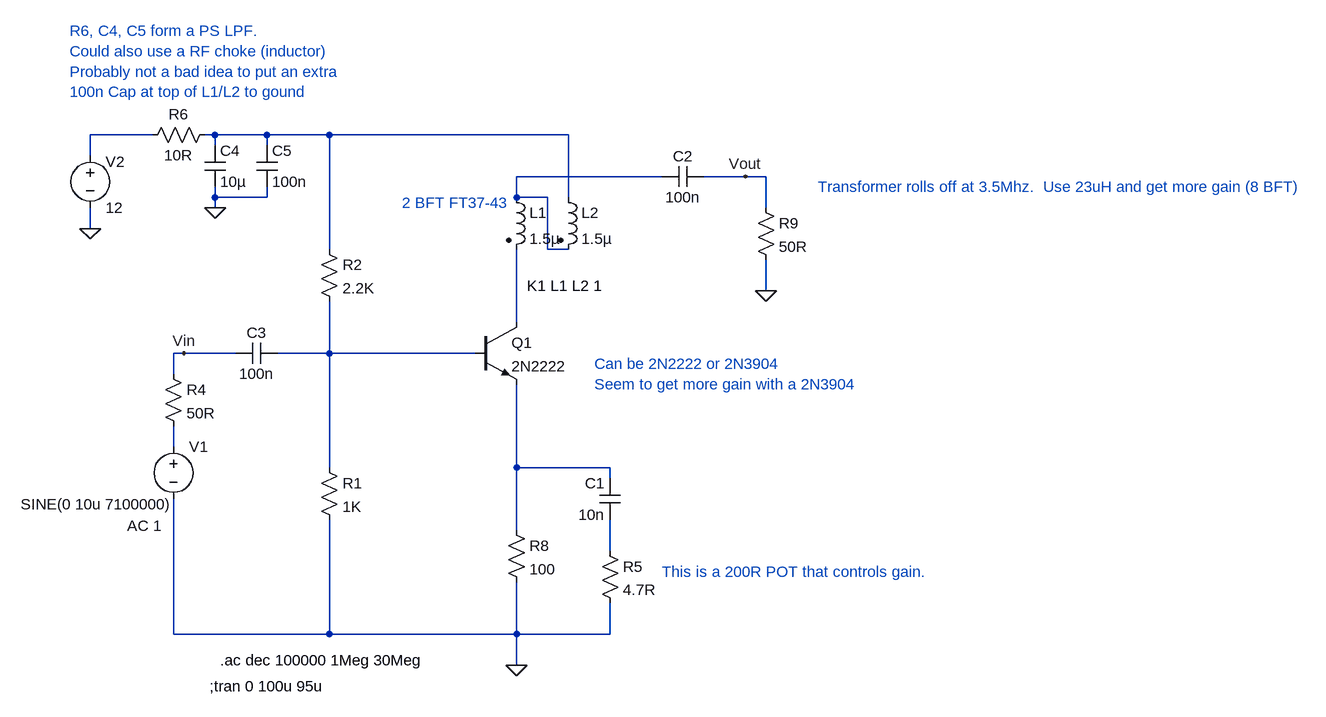
[diagram p0: schematic N6QW 2N2222 Preamp.asc]
N6QW 2N2222 Preamp.asc, the LTspice schematic file:
Version 4
SHEET 1 2072 816
WIRE -240 -176 -336 -176
WIRE -144 -176 -160 -176
WIRE -64 -176 -144 -176
WIRE 32 -176 -64 -176
WIRE 400 -176 32 -176
WIRE -144 -160 -144 -176
WIRE -64 -160 -64 -176
WIRE -336 -144 -336 -176
WIRE 544 -112 320 -112
WIRE 672 -112 608 -112
WIRE 704 -112 672 -112
WIRE -144 -80 -144 -96
WIRE -64 -80 -64 -96
WIRE -64 -80 -144 -80
WIRE 320 -80 320 -112
WIRE 368 -80 320 -80
WIRE 400 -80 400 -176
WIRE -144 -64 -144 -80
WIRE 704 -64 704 -112
WIRE -336 -32 -336 -64
WIRE 32 0 32 -176
WIRE 368 0 368 -80
WIRE 400 0 368 0
WIRE 704 64 704 16
WIRE 320 112 320 0
WIRE -192 160 -208 160
WIRE -112 160 -192 160
WIRE 32 160 32 80
WIRE 32 160 -48 160
WIRE 256 160 32 160
WIRE -208 192 -208 160
WIRE -208 304 -208 272
WIRE 32 336 32 160
WIRE 320 336 320 208
WIRE 464 336 320 336
WIRE 464 352 464 336
WIRE 320 432 320 336
WIRE 464 464 464 416
WIRE -208 592 -208 384
WIRE 32 592 32 416
WIRE 32 592 -208 592
WIRE 320 592 320 512
WIRE 320 592 32 592
WIRE 464 592 464 544
WIRE 464 592 320 592
WIRE 320 640 320 592
FLAG -336 -32 0
FLAG 320 640 0
FLAG -192 160 Vin
FLAG -144 -64 0
FLAG 704 64 0
FLAG 672 -112 Vout
SYMBOL npn 256 112 R0
SYMATTR InstName Q1
SYMATTR Value 2N2222
SYMBOL voltage -208 288 R0
WINDOW 123 -71 137 Left 2
WINDOW 39 -107 169 Left 2
WINDOW 3 -235 104 Left 2
SYMATTR Value2 AC 1
SYMATTR Value SINE(0 10u 7100000)
SYMATTR InstName V1
SYMBOL res 16 320 R0
SYMATTR InstName R1
SYMATTR Value 1K
SYMBOL cap 480 416 R180
WINDOW 0 24 56 Left 2
WINDOW 3 24 8 Left 2
SYMATTR InstName C1
SYMATTR Value 10n
SYMBOL cap -48 144 R90
WINDOW 0 0 32 VBottom 2
WINDOW 3 32 32 VTop 2
SYMATTR InstName C3
SYMATTR Value 100n
SYMBOL res -144 -192 R90
WINDOW 0 0 56 VBottom 2
WINDOW 3 32 56 VTop 2
SYMATTR InstName R6
SYMATTR Value 10R
SYMBOL voltage -336 -160 R0
WINDOW 0 24 25 Left 2
WINDOW 123 0 0 Left 2
WINDOW 39 0 0 Left 2
SYMATTR InstName V2
SYMATTR Value 12
SYMBOL ind2 304 -96 R0
SYMATTR InstName L1
SYMATTR Value 1.5µ
SYMATTR Type ind
SYMBOL ind2 384 -96 R0
SYMATTR InstName L2
SYMATTR Value 1.5µ
SYMATTR Type ind
SYMBOL res 304 416 R0
SYMATTR InstName R8
SYMATTR Value 100
SYMBOL res -224 176 R0
SYMATTR InstName R4
SYMATTR Value 50R
SYMBOL cap -160 -160 R0
SYMATTR InstName C4
SYMATTR Value 10µ
SYMBOL res 16 -16 R0
SYMATTR InstName R2
SYMATTR Value 2.2K
SYMBOL cap -80 -160 R0
SYMATTR InstName C5
SYMATTR Value 100n
SYMBOL res 448 448 R0
SYMATTR InstName R5
SYMATTR Value 4.7R
SYMBOL res 688 -80 R0
SYMATTR InstName R9
SYMATTR Value 50R
SYMBOL cap 608 -128 R90
WINDOW 0 0 32 VBottom 2
WINDOW 3 32 32 VTop 2
SYMATTR InstName C2
SYMATTR Value 100n
TEXT 336 56 Left 2 !K1 L1 L2 1
TEXT -136 632 Left 2 !.ac dec 100000 1Meg 30Meg
TEXT -152 672 Left 2 !;tran 0 100u 95u
TEXT 544 496 Left 2 ;This is a 200R POT that controls gain.
TEXT -368 -336 Left 2 ;R6, C4, C5 form a PS LPF. \nCould also use a RF choke (inductor)\nProbably not a bad idea to put an extra \n100n Cap at top of L1/L2 to gound
TEXT 440 176 Left 2 ;Can be 2N2222 or 2N3904\nSeem to get more gain with a 2N3904
TEXT 144 -72 Left 2 ;2 BFT FT37-43
TEXT 784 -96 Left 2 ;Transformer rolls off at 3.5Mhz.  Use 23uH and get more gain (8 BFT)

The netlist it stands for:
* N6QW 2N2222 Preamp.asc
Q1 N004 N005 N007 0 2N2222
V1 N006 0 SINE(0 10u 7100000) AC 1
R1 N005 0 1K
C1 N008 N007 10n
C3 N005 Vin 100n
R6 N002 N001 10R
V2 N001 0 12
L1 N003 N004 1.5µ
L2 N002 N003 1.5µ
R8 N007 0 100
R4 Vin N006 50R
C4 N002 0 10µ
R2 N002 N005 2.2K
C5 N002 0 100n
R5 N008 0 4.7R
R9 Vout 0 50R
C2 Vout N003 100n
.model NPN NPN
.model PNP PNP
.lib standard.bjt
K1 L1 L2 1
.ac dec 100000 1Meg 30Meg
;tran 0 100u 95u
* This is a 200R POT that controls gain.
* R6, C4, C5 form a PS LPF.
* Could also use a RF choke (inductor)
* Probably not a bad idea to put an extra
* 100n Cap at top of L1/L2 to gound
* Can be 2N2222 or 2N3904
* Seem to get more gain with a 2N3904
* 2 BFT FT37-43
* Transformer rolls off at 3.5Mhz.  Use 23uH and get more gain (8 BFT)
.backanno
.end